# Altium project RV901-cnc.PrjPcb
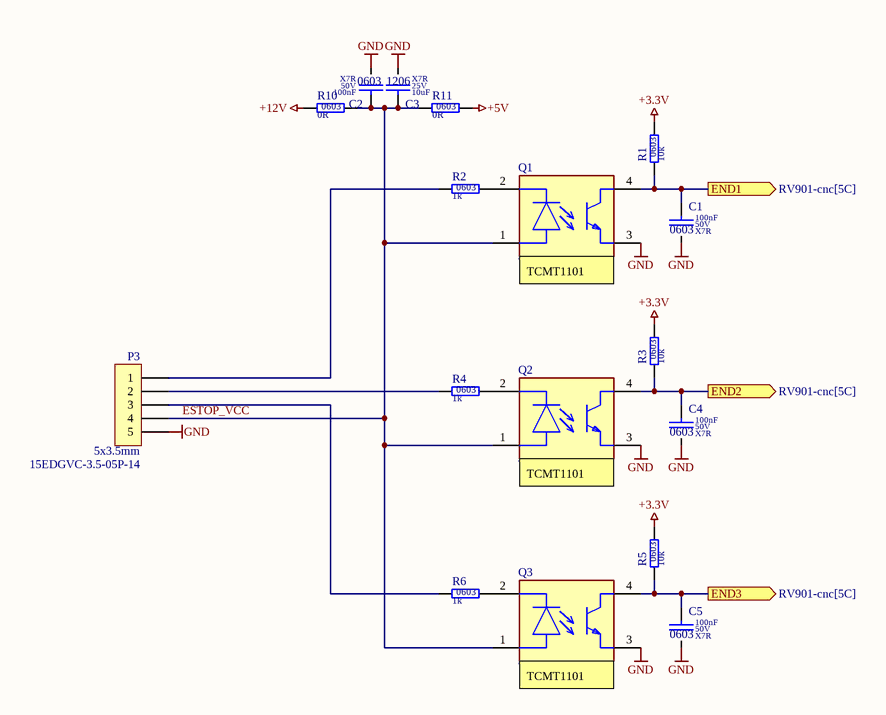
[diagram p0: Endstop.SchDoc]
7 sheets, 134 parts. Net scope: flat (ports and power ports of the same name join across sheets).
Board files: RV901-cnc-flipped.PcbDoc, RV901-cnc.PcbDoc
Sheets:
  Endstop.SchDoc
  Axis.SchDoc
  Encoder.SchDoc
  Serial.SchDoc
  GPI.SchDoc
  GPO.SchDoc
  Power.SchDoc

## Sheet Endstop.SchDoc
size A4; SheetNumber: 2; SheetTotal: 8

### Parts
C1  value 100nF  Dielectric: X7R  Voltage: 50V  SCH_Footprint: 0603  [C_0603_1608]  (hidden comment: Ceramic X7R)
C2  value 100nF  Dielectric: X7R  Voltage: 50V  SCH_Footprint: 0603  [C_0603_1608]  (hidden comment: Ceramic X7R)
C3  value 10uF  Dielectric: X7R  Voltage: 25V  SCH_Footprint: 1206  [C_1206_3216]  (hidden comment: Ceramic X7R)
C4  value 100nF  Dielectric: X7R  Voltage: 50V  SCH_Footprint: 0603  [C_0603_1608]  (hidden comment: Ceramic X7R)
C5  value 100nF  Dielectric: X7R  Voltage: 50V  SCH_Footprint: 0603  [C_0603_1608]  (hidden comment: Ceramic X7R)
P3  value 15EDGVC-3.5-05P-14  SCH_Footprint: 5x3.5mm  [P_15EDGVC-3.5-05P]  (hidden comment: 5-pin 3.5mm terminal block)
Q1  TCMT1106  [FP-TCMT1106-MFG]
Q2  TCMT1106  [FP-TCMT1106-MFG]
Q3  TCMT1106  [FP-TCMT1106-MFG]
R1  value 10k  SCH_Footprint: 0603  [R_0603_1608]  (hidden comment: Resistor)
R2  value 1k  SCH_Footprint: 0603  [R_0603_1608]  (hidden comment: Resistor)
R3  value 10k  SCH_Footprint: 0603  [R_0603_1608]  (hidden comment: Resistor)
R4  value 1k  SCH_Footprint: 0603  [R_0603_1608]  (hidden comment: Resistor)
R5  value 10k  SCH_Footprint: 0603  [R_0603_1608]  (hidden comment: Resistor)
R6  value 1k  SCH_Footprint: 0603  [R_0603_1608]  (hidden comment: Resistor)
R10  value 0R  SCH_Footprint: 0603  [R_0603_1608]  (hidden comment: Resistor)
R11  value 0R  SCH_Footprint: 0603  [R_0603_1608]  (hidden comment: Resistor)

### Ports
END1 (out, see RV901-cnc[5C]), END2 (out, see RV901-cnc[5C]), END3 (out, see RV901-cnc[5C])

### Nets
+3.3V: R1.2 R3.2 R5.2
+5V: R11.2
+12V: R10.1
GND: C1.2 C2.2 C3.2 C4.2 C5.2 P3.5 Q1.3(E) Q2.3(E) Q3.3(E)
ESTOP_VCC: C2.1 C3.1 P3.4 Q1.1(A) Q2.1(A) Q3.1(A) R10.2 R11.1
NetC1_1: C1.1 Q1.4(C) R1.1 ; port END1
NetC4_1: C4.1 Q2.4(C) R3.1 ; port END2
NetC5_1: C5.1 Q3.4(C) R5.1 ; port END3
NetP3_1: P3.1 R2.1
NetP3_2: P3.2 R4.1
NetP3_3: P3.3 R6.1
NetQ1_2: Q1.2(C) R2.2
NetQ2_2: Q2.2(C) R4.2
NetQ3_2: Q3.2(C) R6.2

### Notes on the sheet
- (near Q1) TCMT1101
- (near Q2) TCMT1101
- (near Q3) TCMT1101

### Library data of the parts
C1 C2 C4 C5 = C_100nF_50V_X7R_0603_5: Capacitor; Manufacturer: Samsung; Manufacturer Part Number: CL10B104JB8NNNC; Tolerance (%): 5; Part Number: C_100nF_50V_X7R_0603_5; HelpURL: http://www.tme.eu/pl/Document/4a42202b32dab16128fe107dd69598cc/samsung-chip-cap.pdf; Supplier 1: TME; Supplier Part Number 1: CL10B104JB8NNNC; Supplier 2: RS Components; Supplier Part Number 2: 7665455; Supplier 3: Farnell; Supplier 4: Mouser; Supplier 5: Digi-Key; Supplier Part Number 5: 1276-1033-1-ND; Supplier 6: LCSC; Supplier Part Number 6: C24452
C3 = C_10uF_25V_X7R_1206_10: Capacitor; Manufacturer: Samsung; Manufacturer Part Number: CL31B106KAHNNNE; Tolerance (%): 10; Part Number: C_10uF_25V_X7R_1206_10; HelpURL: http://www.tme.eu/pl/Document/4a42202b32dab16128fe107dd69598cc/samsung-chip-cap.pdf; Supplier 1: TME; Supplier Part Number 1: CL31B106KAHNNNE; Supplier 2: RS Components; Supplier Part Number 2: 766-6773; Supplier 3: Farnell; Supplier Part Number 3: 3013526; Supplier 4: Mouser; Supplier Part Number 4: 187-CL31B106KAHNNNE; Supplier 5: Digi-Key; Supplier Part Number 5: 1276-1804-1-ND; Supplier 6: LCSC
P3 = P_15EDGVC-3.5-05P-14: Pin Header; Manufacturer: DEGSON ELECTRONICS; Part Number: P_15EDGVC-3.5-05P-14; HelpURL: https://www.tme.eu/Document/83e7173fe653a2d0e44585e87978945b/opr014R8.pdf; Manufacturer Part Number: 15EDGVC-3.5-05P-14; Supplier 1: TME; Supplier 2: RS Components; Supplier 3: Farnell; Supplier 4: Mouser; Supplier 5: Digi-Key; Supplier 6: LCSC; Supplier Part Number 6: C7603430; Supplier 7: Conrad; Supplier Part Number 7: 1327356
Q1-Q3 = CMP-00030-39642376-1: TCMT1106 TCMT1106 Vishay Transistor Output Optocouplers Phototransistor Out 3750Vrms1 Channel 4-SOP RoHS; Current Transfer Ratio: 300%; Reverse Voltage: 6V; Number of Channels: 1; Turn-Off Delay Time: 8.5µs; Power Dissipation: 250mW; Output Current per Channel: 50mA; Voltage Rating (DC): 70V; Forward Current: 60mA; Turn-On Delay Time: 9.5µs; Rise Time: 3s; Isolation Voltage: 3.75kV; Fall Time: 4.7s; Max Junction Temperature (Tj): 125°C; Collector Emitter Saturation Voltage: 300mV; Forward Voltage: 1.35V; Ambient Temperature Range High: 100°C; Height: 2.3mm; Mount: PCB, Surface Mount; Max Operating Temperature: 100°C; Radiation Hardening: No; RoHS: Compliant; Min Operating Temperature: -40°C; NexarPartId: 39642376; Number of Pins: 4; Output Voltage: 70V; Max Output Voltage: 70V; Reverse Breakdown Voltage: 6V; Voltage: 6V; Collector Emitter Voltage (VCEO): 70V; Number of Elements: 1; Max Collector Current: 50mA; Schedule B: 8541408000, 8541408000; Input Current: 50mA; Max Power Dissipation: 250mW; Packaging: Tape and Reel; Max Input Current: 60mA; Case/Package: SOP; Lead Free: Lead Free; REACH SVHC: Unknown
R1 R3 R5 = R_10k_0603_1_AECQ0: Manufacturer: Panasonic; Manufacturer Part Number: ERJ-3EKF1002V; Voltage: 75V; Power: 100mW; Tolerance: 1%; AEC-Q: 0; Part Number: R_10k_0603_1_AECQ0; HelpURL: https://industrial.panasonic.com/cdbs/www-data/pdf/RDA0000/AOA0000C304.pdf; Supplier 1: TME; Supplier Part Number 1: ERJ3EKF1002V; Supplier 2: RS Components; Supplier 3: Farnell; Supplier Part Number 3: 2303192; Supplier 4: Mouser; Supplier Part Number 4: 667-ERJ-3EKF1002V; Supplier 5: Digi-Key; Supplier Part Number 5: P10.0KHCT-ND; Supplier 6: LCSC; Supplier Part Number 6: C191124
R2 R4 R6 = R_1k_0603_1_AECQ0: Manufacturer: Panasonic; Manufacturer Part Number: ERJ-3EKF1001V; Voltage: 75V; Power: 100mW; Tolerance: 1%; AEC-Q: 0; Part Number: R_1k_0603_1_AECQ0; HelpURL: https://industrial.panasonic.com/cdbs/www-data/pdf/RDA0000/AOA0000C304.pdf; Supplier 1: TME; Supplier Part Number 1: ERJ3EKF1001V; Supplier 2: RS Components; Supplier 3: Farnell; Supplier Part Number 3: 2303145; Supplier 4: Mouser; Supplier Part Number 4: 667-ERJ-3EKF1001V; Supplier 5: Digi-Key; Supplier Part Number 5: P1.00KHCT-ND; Supplier 6: LCSC
R10 R11 = R_0R_0603_1: Manufacturer: Yageo; Manufacturer Part Number: RC0603FR-070RL; Voltage: 75V; Power: 100mW; Tolerance: 1%; Part Number: R_0R_0603_1; HelpURL: https://datasheet.octopart.com/RC0603FR-070RL-Yageo-datasheet-8328172.pdf; Supplier 1: TME; Supplier Part Number 1: RC0603FR-070RL; Supplier 2: RS Components; Supplier 3: Farnell; Supplier Part Number 3: 2309106; Supplier 4: Mouser; Supplier Part Number 4: 603-RC0603FR-070RL; Supplier 5: Digi-Key; Supplier Part Number 5: 311-0.0HRCT-ND; Supplier 6: LCSC; Supplier Part Number 6: C100044

## Sheet Axis.SchDoc
size A4; SheetNumber: 3; SheetTotal: 8
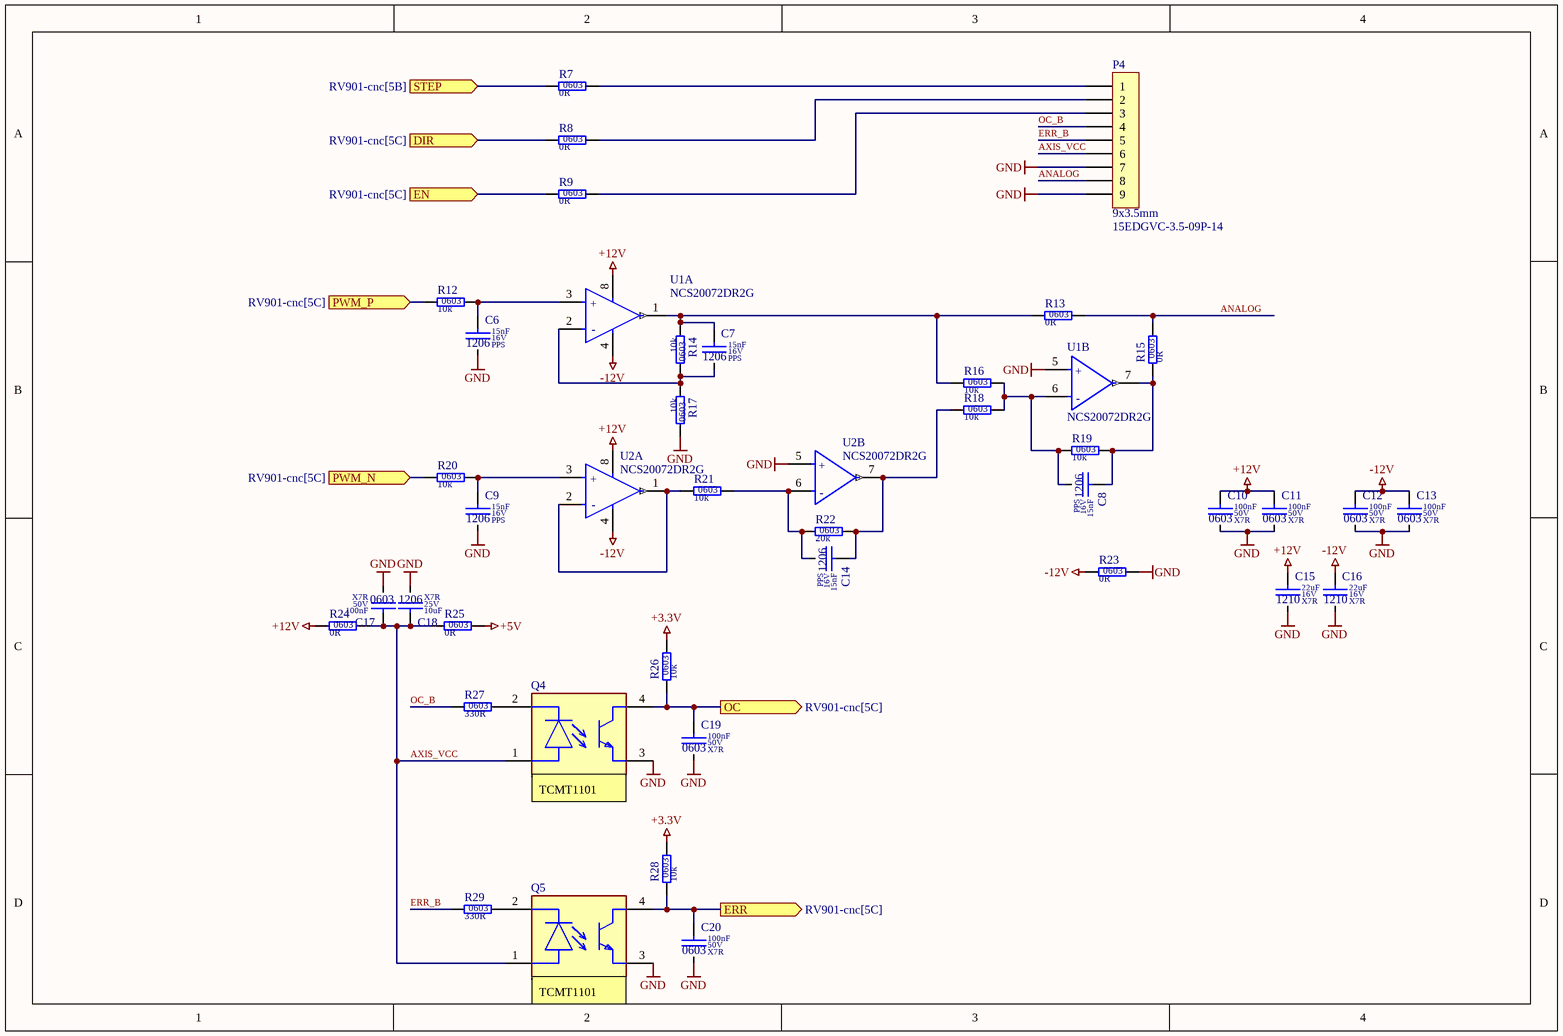
[diagram p1: Axis.SchDoc]

### Parts
C6  value 15nF  Dielectric: PPS  Voltage: 16V  SCH_Footprint: 1206  [C_1206_3216]  (hidden comment: Film Capacitor)
C7  value 15nF  Dielectric: PPS  Voltage: 16V  SCH_Footprint: 1206  [C_1206_3216]  (hidden comment: Film Capacitor)
C8  value 15nF  Dielectric: PPS  Voltage: 16V  SCH_Footprint: 1206  [C_1206_3216]  (hidden comment: Film Capacitor)
C9  value 15nF  Dielectric: PPS  Voltage: 16V  SCH_Footprint: 1206  [C_1206_3216]  (hidden comment: Film Capacitor)
C10  value 100nF  Dielectric: X7R  Voltage: 50V  SCH_Footprint: 0603  [C_0603_1608]  (hidden comment: Ceramic X7R)
C11  value 100nF  Dielectric: X7R  Voltage: 50V  SCH_Footprint: 0603  [C_0603_1608]  (hidden comment: Ceramic X7R)
C12  value 100nF  Dielectric: X7R  Voltage: 50V  SCH_Footprint: 0603  [C_0603_1608]  (hidden comment: Ceramic X7R)
C13  value 100nF  Dielectric: X7R  Voltage: 50V  SCH_Footprint: 0603  [C_0603_1608]  (hidden comment: Ceramic X7R)
C14  value 15nF  Dielectric: PPS  Voltage: 16V  SCH_Footprint: 1206  [C_1206_3216]  (hidden comment: Film Capacitor)
C15  value 22uF  Dielectric: X7R  Voltage: 16V  SCH_Footprint: 1210  [C_1210_3225]  (hidden comment: Ceramic X7R)
C16  value 22uF  Dielectric: X7R  Voltage: 16V  SCH_Footprint: 1210  [C_1210_3225]  (hidden comment: Ceramic X7R)
C17  value 100nF  Dielectric: X7R  Voltage: 50V  SCH_Footprint: 0603  [C_0603_1608]  (hidden comment: Ceramic X7R)
C18  value 10uF  Dielectric: X7R  Voltage: 25V  SCH_Footprint: 1206  [C_1206_3216]  (hidden comment: Ceramic X7R)
C19  value 100nF  Dielectric: X7R  Voltage: 50V  SCH_Footprint: 0603  [C_0603_1608]  (hidden comment: Ceramic X7R)
C20  value 100nF  Dielectric: X7R  Voltage: 50V  SCH_Footprint: 0603  [C_0603_1608]  (hidden comment: Ceramic X7R)
P4  value 15EDGVC-3.5-09P-14  SCH_Footprint: 9x3.5mm  [P_15EDGVC-3.5-09P]  (hidden comment: 9-pin 3.5mm terminal block)
Q4  TCMT1106  [FP-TCMT1106-MFG]
Q5  TCMT1106  [FP-TCMT1106-MFG]
R7  value 0R  SCH_Footprint: 0603  [R_0603_1608]  (hidden comment: Resistor)
R8  value 0R  SCH_Footprint: 0603  [R_0603_1608]  (hidden comment: Resistor)
R9  value 0R  SCH_Footprint: 0603  [R_0603_1608]  (hidden comment: Resistor)
R12  value 10k  SCH_Footprint: 0603  [R_0603_1608]  (hidden comment: Resistor)
R13  value 0R  SCH_Footprint: 0603  [R_0603_1608]  (hidden comment: Resistor)
R14  value 10k  SCH_Footprint: 0603  [R_0603_1608]  (hidden comment: Resistor)
R15  value 0R  SCH_Footprint: 0603  [R_0603_1608]  (hidden comment: Resistor)
R16  value 10k  SCH_Footprint: 0603  [R_0603_1608]  (hidden comment: Resistor)
R17  value 10k  SCH_Footprint: 0603  [R_0603_1608]  (hidden comment: Resistor)
R18  value 10k  SCH_Footprint: 0603  [R_0603_1608]  (hidden comment: Resistor)
R19  value 10k  SCH_Footprint: 0603  [R_0603_1608]  (hidden comment: Resistor)
R20  value 10k  SCH_Footprint: 0603  [R_0603_1608]  (hidden comment: Resistor)
R21  value 10k  SCH_Footprint: 0603  [R_0603_1608]  (hidden comment: Resistor)
R22  value 20k  SCH_Footprint: 0603  [R_0603_1608]  (hidden comment: Resistor)
R23  value 0R  SCH_Footprint: 0603  [R_0603_1608]  (hidden comment: Resistor)
R24  value 0R  SCH_Footprint: 0603  [R_0603_1608]  (hidden comment: Resistor)
R25  value 0R  SCH_Footprint: 0603  [R_0603_1608]  (hidden comment: Resistor)
R26  value 10k  SCH_Footprint: 0603  [R_0603_1608]  (hidden comment: Resistor)
R27  value 330R  SCH_Footprint: 0603  [R_0603_1608]  (hidden comment: Resistor)
R28  value 10k  SCH_Footprint: 0603  [R_0603_1608]  (hidden comment: Resistor)
R29  value 330R  SCH_Footprint: 0603  [R_0603_1608]  (hidden comment: Resistor)
U1  NCS20072DR2G  [FP-751-07-MFG]  (parts A,B of 2)
U2  NCS20072DR2G  [FP-751-07-MFG]  (parts A,B of 2)

### Ports
DIR (in, see RV901-cnc[5C]), EN (in, see RV901-cnc[5C]), ERR (out, see RV901-cnc[5C]), OC (out, see RV901-cnc[5C]), PWM_N (in, see RV901-cnc[5C]), PWM_P (in, see RV901-cnc[5C]), STEP (in, see RV901-cnc[5B])

### Nets
+3.3V: R26.2 R28.2
+5V: R25.2
+12V: C10.1 C11.1 C15.1 R24.1 U1.8(VDD) U2.8(VDD)
-12V: C12.1 C13.1 C16.1 R23.1 U1.4(VSS) U2.4(VSS)
GND: C6.2 C9.2 C10.2 C11.2 C12.2 C13.2 C15.2 C16.2 C17.2 C18.2 C19.2 C20.2 P4.7 P4.9 Q4.3(E) Q5.3(E) R17.2 R23.2 U1.5(IN+_2) U2.5(IN+_2)
ANALOG: P4.8 R13.2 R15.2
AXIS_VCC: C17.1 C18.1 P4.6 Q4.1(A) Q5.1(A) R24.2 R25.1
ERR_B: P4.5 R29.1
OC_B: P4.4 R27.1
NetC6_1: C6.1 R12.2 U1.3(IN+_1)
NetC7_1: C7.1 R13.1 R14.1 R16.1 U1.1(OUT_1)
NetC7_2: C7.2 R14.2 R17.1 U1.2(IN-_1)
NetC8_1: C8.1 R15.1 R19.2 U1.7(OUT_2)
NetC8_2: C8.2 R16.2 R18.2 R19.1 U1.6(IN-_2)
NetC9_1: C9.1 R20.2 U2.3(IN+_1)
NetC14_1: C14.1 R18.1 R22.2 U2.7(OUT_2)
NetC14_2: C14.2 R21.2 R22.1 U2.6(IN-_2)
NetC19_1: C19.1 Q4.4(C) R26.1 ; port OC
NetC20_1: C20.1 Q5.4(C) R28.1 ; port ERR
NetP4_1: P4.1 R7.2
NetP4_2: P4.2 R8.2
NetP4_3: P4.3 R9.2
NetQ4_2: Q4.2(C) R27.2
NetQ5_2: Q5.2(C) R29.2
NetR7_1: R7.1 ; port STEP
NetR8_1: R8.1 ; port DIR
NetR9_1: R9.1 ; port EN
NetR12_1: R12.1 ; port PWM_P
NetR20_1: R20.1 ; port PWM_N
NetR21_1: R21.1 U2.1(OUT_1) U2.2(IN-_1)

### Notes on the sheet
- (near Q4) TCMT1101
- (near Q5) TCMT1101
- (in symbol CMP-07106-000003-1, part A) +; -
- (in symbol CMP-07106-000003-1, part B) +; -

### Library data of the parts
C6-C9 C14 = C_15nF_16V_PPS_1206_2: Capacitor; Manufacturer: Panasonic; Manufacturer Part Number: ECH-U1C153GX5; Tolerance (%): 2; Part Number: C_15nF_16V_PPS_1206_2; HelpURL: https://mediap.industry.panasonic.eu/assets/imported/industrial.panasonic.com/cdbs/www-data/pdf/RDI0000/ABD0000C173.pdf; Supplier 1: TME; Supplier Part Number 1: ECHU1C153GX5; Supplier 2: RS Components; Supplier Part Number 2: 414-7018; Supplier 3: Farnell; Supplier Part Number 3: 9694900; Supplier 4: Mouser; Supplier Part Number 4: 667-ECH-U1C153GX5; Supplier 5: Digi-Key; Supplier Part Number 5: PCF1179CT-ND; Supplier 6: LCSC
C10-C13 C17 C19 C20 = C_100nF_50V_X7R_0603_5: as C1 on sheet Endstop; Part Number: C_100nF_50V_X7R_0603_5; HelpURL: http://www.tme.eu/pl/Document/4a42202b32dab16128fe107dd69598cc/samsung-chip-cap.pdf; Supplier 1: TME; Supplier Part Number 1: CL10B104JB8NNNC; Supplier 2: RS Components; Supplier Part Number 2: 7665455; Supplier 3: Farnell; Supplier 4: Mouser; Supplier 5: Digi-Key; Supplier Part Number 5: 1276-1033-1-ND; Supplier 6: LCSC; Supplier Part Number 6: C24452
C15 C16 = C_22uF_16V_X7R_1210_10_AECQ1: Capacitor; Manufacturer: Murata; Manufacturer Part Number: GCM32ER71C226KE19L; Tolerance (%): 10; AEC-Q: 1; Part Number: C_22uF_16V_X7R_1210_10_AECQ1; HelpURL: https://www.murata.com/products/productdetail?partno=GCM32ER71C226KE19%23; Supplier 1: TME; Supplier Part Number 1: GCM32ER71C226KE19L; Supplier 2: RS Components; Supplier 3: Farnell; Supplier Part Number 3: 3790409; Supplier 4: Mouser; Supplier Part Number 4: 81-GCM32ER71C226K19L; Supplier 5: Digi-Key; Supplier Part Number 5: 490-5242-1-ND; Supplier 6: LCSC; Supplier Part Number 6: C126614
C18 = C_10uF_25V_X7R_1206_10: as C3 on sheet Endstop; Part Number: C_10uF_25V_X7R_1206_10; HelpURL: http://www.tme.eu/pl/Document/4a42202b32dab16128fe107dd69598cc/samsung-chip-cap.pdf; Supplier 1: TME; Supplier Part Number 1: CL31B106KAHNNNE; Supplier 2: RS Components; Supplier Part Number 2: 766-6773; Supplier 3: Farnell; Supplier Part Number 3: 3013526; Supplier 4: Mouser; Supplier Part Number 4: 187-CL31B106KAHNNNE; Supplier 5: Digi-Key; Supplier Part Number 5: 1276-1804-1-ND; Supplier 6: LCSC
P4 = P_15EDGVC-3.5-09P-14: Pin Header; Manufacturer: DEGSON ELECTRONICS; Part Number: P_15EDGVC-3.5-09P-14; HelpURL: https://www.tme.eu/Document/83e7173fe653a2d0e44585e87978945b/opr014R8.pdf; Manufacturer Part Number: 15EDGVC-3.5-09P-14; Supplier 1: TME; Supplier 2: RS Components; Supplier 3: Farnell; Supplier 4: Mouser; Supplier 5: Digi-Key; Supplier 6: LCSC; Supplier Part Number 6: C5188325; Supplier 7: Micros; Supplier Part Number 7: Z TLPHC001v-09p
Q4 Q5 = CMP-00030-39642376-1: as Q1 on sheet Endstop; Ambient Temperature Range High: 100°C; Height: 2.3mm; Mount: PCB, Surface Mount; Max Operating Temperature: 100°C; Radiation Hardening: No; RoHS: Compliant; Min Operating Temperature: -40°C; NexarPartId: 39642376; Number of Pins: 4; Output Voltage: 70V; Max Output Voltage: 70V; Reverse Breakdown Voltage: 6V; Voltage: 6V; Collector Emitter Voltage (VCEO): 70V; Number of Elements: 1; Max Collector Current: 50mA; Schedule B: 8541408000, 8541408000; Input Current: 50mA; Max Power Dissipation: 250mW; Packaging: Tape and Reel; Max Input Current: 60mA; Case/Package: SOP; Lead Free: Lead Free; REACH SVHC: Unknown
R7-R9 R13 R15 R23-R25 = R_0R_0603_1: as R10 on sheet Endstop; Part Number: R_0R_0603_1; HelpURL: https://datasheet.octopart.com/RC0603FR-070RL-Yageo-datasheet-8328172.pdf; Supplier 1: TME; Supplier Part Number 1: RC0603FR-070RL; Supplier 2: RS Components; Supplier 3: Farnell; Supplier Part Number 3: 2309106; Supplier 4: Mouser; Supplier Part Number 4: 603-RC0603FR-070RL; Supplier 5: Digi-Key; Supplier Part Number 5: 311-0.0HRCT-ND; Supplier 6: LCSC; Supplier Part Number 6: C100044
R12 R14 R16-R21 R26 R28 = R_10k_0603_1_AECQ0: as R1 on sheet Endstop; Part Number: R_10k_0603_1_AECQ0; HelpURL: https://industrial.panasonic.com/cdbs/www-data/pdf/RDA0000/AOA0000C304.pdf; Supplier 1: TME; Supplier Part Number 1: ERJ3EKF1002V; Supplier 2: RS Components; Supplier 3: Farnell; Supplier Part Number 3: 2303192; Supplier 4: Mouser; Supplier Part Number 4: 667-ERJ-3EKF1002V; Supplier 5: Digi-Key; Supplier Part Number 5: P10.0KHCT-ND; Supplier 6: LCSC; Supplier Part Number 6: C191124
R22 = R_20k_0603_1_AECQ0: Manufacturer: Panasonic; Manufacturer Part Number: ERJ-3EKF2002V; Voltage: 75V; Power: 100mW; Tolerance: 1%; AEC-Q: 0; Part Number: R_20k_0603_1_AECQ0; HelpURL: https://industrial.panasonic.com/cdbs/www-data/pdf/RDA0000/AOA0000C304.pdf; Supplier 1: TME; Supplier Part Number 1: ERJ3EKF2002V; Supplier 2: RS Components; Supplier 3: Farnell; Supplier Part Number 3: 2059432; Supplier 4: Mouser; Supplier Part Number 4: 667-ERJ-3EKF2002V; Supplier 5: Digi-Key; Supplier Part Number 5: P20.0KHCT-ND; Supplier 6: LCSC; Supplier Part Number 6: C403057
R27 R29 = R_330R_0603_1: Manufacturer: Yageo; Manufacturer Part Number: RC0603FR-07330RL; Voltage: 50V; Power: 100mW; Tolerance: 1%; Part Number: R_330R_0603_1; HelpURL: http://datasheet.octopart.com/RC0603FR-07330RL-Yageo-datasheet-8328172.pdf; Supplier 1: TME; Supplier Part Number 1: RC0603FR-07330R; Supplier 2: RS Components; Supplier Part Number 2: 5046499; Supplier 3: Farnell; Supplier Part Number 3: 9238425; Supplier 4: Mouser; Supplier Part Number 4: 603-RC0603FR-07330RL; Supplier 5: Digi-Key; Supplier Part Number 5: 311-330HRCT-ND; Supplier 6: LCSC
U1 U2 = CMP-07106-000003-1: IC OPAMP 3MHZ RRO DUAL 8SOIC; Manufacturer: ON Semiconductor; Standoff Height: 0.1mm; Voltage Gain: 118-120dB; Max Junction Temp: +150°C; Min Supply Voltage: 2.7V; Max Dual Supply Voltage: 18V; Output Current Per Channel: 465uA; Input Bias Current: 0.000005uA; Input Offset Voltage: 1.3mV; Min Dual Supply Voltage: 1.35V; Max Supply Voltage: 36V; Nominal Supply Current: 405-465uA; Number Of Channels: 2; Gain Bandwidth: 3MHz; Temperature: -40°C to +125°C; Temperature Range High: +125°C; Ambient Temperature Range Low: -40°C; Device Class L1: Integrated Circuits (ICs); ComponentLink2Description: Datasheet; Package: 751-07; Lead Free: Yes; ComponentLink2URL: http://www.onsemi.com/pub/Collateral/NCS20071-D.PDF; Mouser Description: Operational Amplifiers - Op Amps R2R DUAL AMPLIFIER; Manufacturer Part Number: NCS20072DR2G; Octopart: https://octopart.com/ncs20072dr2g-on+semiconductor-56676507; Automotive: No; Device Class L3: Amplifiers - Op Amps; Device Class L2: Linear ICs; Category: IC; Bandwidth: 3MHz; Footprint Url: http://www.onsemi.com/pub/Collateral/751-07.PDF; RoHS: TRUE; Temperature Range Low: -40°C; Ambient Temperature Range High: +125°C; Height: 1.75mm; Digikey Description: IC OPAMP 3MHZ RRO DUAL 8SOIC

## Sheet Encoder.SchDoc
size A4; SheetNumber: 4; SheetTotal: 8
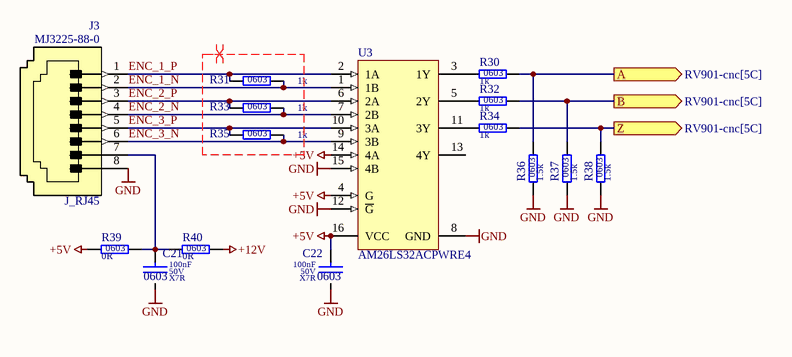
[diagram p2: Encoder.SchDoc]

### Parts
C21  value 100nF  Dielectric: X7R  Voltage: 50V  SCH_Footprint: 0603  [C_0603_1608]  (hidden comment: Ceramic X7R)
C22  value 100nF  Dielectric: X7R  Voltage: 50V  SCH_Footprint: 0603  [C_0603_1608]  (hidden comment: Ceramic X7R)
J3  value MJ3225-88-0  [J_RJ45_MJ3225-88-0]  (hidden comment: Modular Connector, Modular Jack, 1 x 1 (Port), 8P8C, Cat3)
R30  value 1k  SCH_Footprint: 0603  [R_0603_1608]  (hidden comment: Resistor)
R31  value 1k  SCH_Footprint: 0603  [R_0603_1608]  (hidden comment: Resistor)
R32  value 1k  SCH_Footprint: 0603  [R_0603_1608]  (hidden comment: Resistor)
R33  value 1k  SCH_Footprint: 0603  [R_0603_1608]  (hidden comment: Resistor)
R34  value 1k  SCH_Footprint: 0603  [R_0603_1608]  (hidden comment: Resistor)
R35  value 1k  SCH_Footprint: 0603  [R_0603_1608]  (hidden comment: Resistor)
R36  value 1.5k  SCH_Footprint: 0603  [R_0603_1608]  (hidden comment: Resistor)
R37  value 1.5k  SCH_Footprint: 0603  [R_0603_1608]  (hidden comment: Resistor)
R38  value 1.5k  SCH_Footprint: 0603  [R_0603_1608]  (hidden comment: Resistor)
R39  value 0R  SCH_Footprint: 0603  [R_0603_1608]  (hidden comment: Resistor)
R40  value 0R  SCH_Footprint: 0603  [R_0603_1608]  (hidden comment: Resistor)
U3  AM26LS32ACPWRE4  [PW16_L]

### Ports
A (out, see RV901-cnc[5C]), B (out, see RV901-cnc[5C]), Z (out, see RV901-cnc[5C])

### Nets
+5V: C22.1 R39.1 U3.4(G) U3.14(4A) U3.16(VCC)
+12V: R40.2
GND: C21.2 C22.2 J3.8 R36.1 R37.1 R38.1 U3.8(GND) U3.12(~{G}) U3.15(4B)
ENC_1_N: J3.2 R31.2 U3.1(1B)
ENC_1_P: J3.1 R31.1 U3.2(1A)
ENC_2_N: J3.4 R33.2 U3.7(2B)
ENC_2_P: J3.3 R33.1 U3.6(2A)
ENC_3_N: J3.6 R35.2 U3.9(3B)
ENC_3_P: J3.5 R35.1 U3.10(3A)
NetC21_1: C21.1 J3.7 R39.2 R40.1
NetR30_1: R30.1 U3.3(1Y)
NetR30_2: R30.2 R36.2 ; port A
NetR32_1: R32.1 U3.5(2Y)
NetR32_2: R32.2 R37.2 ; port B
NetR34_1: R34.1 U3.11(3Y)
NetR34_2: R34.2 R38.2 ; port Z

Not connected (* = marked no-connect by the designer): U3 13(4Y)

### Layout directives
differential pair: (no net found under the mark)

### Notes on the sheet
- (in symbol J_RJ45_MJ3225-88-0) J1; J2; J4; J5; J6; J7; J8

### Library data of the parts
C21 C22 = C_100nF_50V_X7R_0603_5: as C1 on sheet Endstop; Part Number: C_100nF_50V_X7R_0603_5; HelpURL: http://www.tme.eu/pl/Document/4a42202b32dab16128fe107dd69598cc/samsung-chip-cap.pdf; Supplier 1: TME; Supplier Part Number 1: CL10B104JB8NNNC; Supplier 2: RS Components; Supplier Part Number 2: 7665455; Supplier 3: Farnell; Supplier 4: Mouser; Supplier 5: Digi-Key; Supplier Part Number 5: 1276-1033-1-ND; Supplier 6: LCSC; Supplier Part Number 6: C24452
J3 = J_RJ45_MJ3225-88-0: Manufacturer: Global Connector Technology; SCH_Footprint: J_RJ45; Part Number: J_RJ45_MJ3225-88-0; HelpURL: https://www.farnell.com/cad/3781788.pdf; Manufacturer Part Number: MJ3225-88-0; Supplier 1: TME; Supplier 2: RS Components; Supplier 3: Farnell; Supplier Part Number 3: 4071641; Supplier 4: Mouser; Supplier 5: Digi-Key; Supplier 6: LCSC; Supplier 7: Newark; Supplier Part Number 7: 61AK4308
R30-R35 = R_1k_0603_1_AECQ0: as R2 on sheet Endstop; Part Number: R_1k_0603_1_AECQ0; HelpURL: https://industrial.panasonic.com/cdbs/www-data/pdf/RDA0000/AOA0000C304.pdf; Supplier 1: TME; Supplier Part Number 1: ERJ3EKF1001V; Supplier 2: RS Components; Supplier 3: Farnell; Supplier Part Number 3: 2303145; Supplier 4: Mouser; Supplier Part Number 4: 667-ERJ-3EKF1001V; Supplier 5: Digi-Key; Supplier Part Number 5: P1.00KHCT-ND; Supplier 6: LCSC
R36-R38 = R_1.5k_0603_1: Manufacturer: Yageo; Manufacturer Part Number: RC0603FR-071K5L; Voltage: 50V; Power: 100mW; Tolerance: 1%; Part Number: R_1.5k_0603_1; HelpURL: https://www.tme.eu/pl/Document/d2a72e545e5c8eb7bf2a04fa97535928/rc0603yageo.pdf; Supplier 1: TME; Supplier Part Number 1: RC0603FR-071K5; Supplier 2: RS Components; Supplier 3: Farnell; Supplier Part Number 3: 9238506; Supplier 4: Mouser; Supplier Part Number 4: 603-RC0603FR-071K5L; Supplier 5: Digi-Key; Supplier Part Number 5: 311-1.50KHRCT-ND; Supplier 6: LCSC
R39 R40 = R_0R_0603_1: as R10 on sheet Endstop; Part Number: R_0R_0603_1; HelpURL: https://datasheet.octopart.com/RC0603FR-070RL-Yageo-datasheet-8328172.pdf; Supplier 1: TME; Supplier Part Number 1: RC0603FR-070RL; Supplier 2: RS Components; Supplier 3: Farnell; Supplier Part Number 3: 2309106; Supplier 4: Mouser; Supplier Part Number 4: 603-RC0603FR-070RL; Supplier 5: Digi-Key; Supplier Part Number 5: 311-0.0HRCT-ND; Supplier 6: LCSC; Supplier Part Number 6: C100044
U3 = CMP-0310-00535-1: Quadruple Differential Line Receiver, 0 TX / 4 RX, 0 to 70 degC, 16-PinTSSOP (PW), Green (RoHS & no Sb/Br); Manufacturer: Texas Instruments; SubFamily: RS-422; ICC(Max)(mA): 70; Receivers Per Package: 4; Rating: Catalog; PackageReference: PW16; PackageDescription: 16-Pin Plastic Thin Small Outline Package 5 x 4.4 mm Body ,0.65 mm Pitch; ComponentLink2URL: http://www.ti.com/lit/ml/mpds361/mpds361.pdf; DatasheetVersion: SLLS115E; # of TX/RX: 0 TX / 4 RX; Eco-Plan: Green (RoHS & no Sb/Br); ComponentLink1URL: http://www.ti.com/general/docs/lit/getliterature.tsp?genericPartNumber=AM26LS32AC&fileType=pdf; ComponentLink1Description: Datasheet; Mounting Technology: Surface Mount; ComponentLink2Description: Package Specification; PackageVersion: revG, Feb-2011; Code_JEDEC: MO-153; PartNumber: AM26LS32ACPWRE4

## Sheet Serial.SchDoc
size A4; SheetNumber: 5; SheetTotal: 8
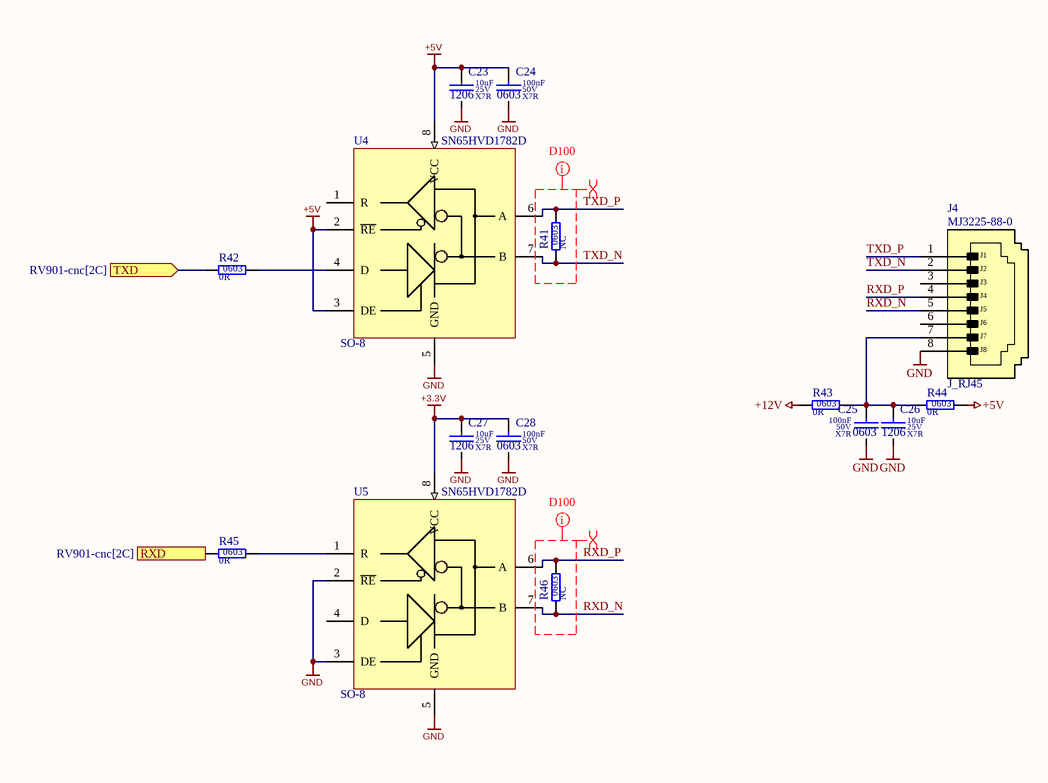
[diagram p3: Serial.SchDoc]

### Parts
C23  value 10uF  Dielectric: X7R  Voltage: 25V  SCH_Footprint: 1206  [C_1206_3216]  (hidden comment: Ceramic X7R)
C24  value 100nF  Dielectric: X7R  Voltage: 50V  SCH_Footprint: 0603  [C_0603_1608]  (hidden comment: Ceramic X7R)
C25  value 100nF  Dielectric: X7R  Voltage: 50V  SCH_Footprint: 0603  [C_0603_1608]  (hidden comment: Ceramic X7R)
C26  value 10uF  Dielectric: X7R  Voltage: 25V  SCH_Footprint: 1206  [C_1206_3216]  (hidden comment: Ceramic X7R)
C27  value 10uF  Dielectric: X7R  Voltage: 25V  SCH_Footprint: 1206  [C_1206_3216]  (hidden comment: Ceramic X7R)
C28  value 100nF  Dielectric: X7R  Voltage: 50V  SCH_Footprint: 0603  [C_0603_1608]  (hidden comment: Ceramic X7R)
J4  value MJ3225-88-0  [J_RJ45_MJ3225-88-0]  (hidden comment: Modular Connector, Modular Jack, 1 x 1 (Port), 8P8C, Cat3)
R41  value NC  SCH_Footprint: 0603  [R_NC_0603_1608]  (hidden comment: Resistor)
R42  value 0R  SCH_Footprint: 0603  [R_0603_1608]  (hidden comment: Resistor)
R43  value 0R  SCH_Footprint: 0603  [R_0603_1608]  (hidden comment: Resistor)
R44  value 0R  SCH_Footprint: 0603  [R_0603_1608]  (hidden comment: Resistor)
R45  value 0R  SCH_Footprint: 0603  [R_0603_1608]  (hidden comment: Resistor)
R46  value NC  SCH_Footprint: 0603  [R_NC_0603_1608]  (hidden comment: Resistor)
U4  value SN65HVD1782D  SCH_Footprint: SO-8  [SOP8_SO8_SOIC8_4X5X18]  (hidden comment: Transceiver)
U5  value SN65HVD1782D  SCH_Footprint: SO-8  [SOP8_SO8_SOIC8_4X5X18]  (hidden comment: Transceiver)

### Ports
RXD (out, see RV901-cnc[2C]), TXD (in, see RV901-cnc[2C])

### Nets
+3.3V: C27.1 C28.1 U5.8(VCC)
+5V: C23.1 C24.1 R44.2 U4.2(~{RE}) U4.3(DE) U4.8(VCC)
+12V: R43.1
GND: C23.2 C24.2 C25.2 C26.2 C27.2 C28.2 J4.8 U4.5(GND) U5.2(~{RE}) U5.3(DE) U5.5(GND)
RXD_N: J4.5 R46.1 U5.7(B)
RXD_P: J4.4 R46.2 U5.6(A)
TXD_N: J4.2 R41.1 U4.7(B)
TXD_P: J4.1 R41.2 U4.6(A)
NetC25_1: C25.1 C26.1 J4.7 R43.2 R44.1
NetR42_1: R42.1 ; port TXD
NetR42_2: R42.2 U4.4(D)
NetR45_1: R45.1 ; port RXD
NetR45_2: R45.2 U5.1(R)

Not connected (* = marked no-connect by the designer): J4 3 6; U4 1(R); U5 4(D)

### Layout directives
differential pair: (no net found under the mark)
net class D100: (no net found under the mark)

### Notes on the sheet
- (in symbol J_RJ45_MJ3225-88-0) J1; J2; J3; J5; J6; J7; J8

### Library data of the parts
C23 C26 C27 = C_10uF_25V_X7R_1206_10: as C3 on sheet Endstop; Part Number: C_10uF_25V_X7R_1206_10; HelpURL: http://www.tme.eu/pl/Document/4a42202b32dab16128fe107dd69598cc/samsung-chip-cap.pdf; Supplier 1: TME; Supplier Part Number 1: CL31B106KAHNNNE; Supplier 2: RS Components; Supplier Part Number 2: 766-6773; Supplier 3: Farnell; Supplier Part Number 3: 3013526; Supplier 4: Mouser; Supplier Part Number 4: 187-CL31B106KAHNNNE; Supplier 5: Digi-Key; Supplier Part Number 5: 1276-1804-1-ND; Supplier 6: LCSC
C24 C25 C28 = C_100nF_50V_X7R_0603_5: as C1 on sheet Endstop; Part Number: C_100nF_50V_X7R_0603_5; HelpURL: http://www.tme.eu/pl/Document/4a42202b32dab16128fe107dd69598cc/samsung-chip-cap.pdf; Supplier 1: TME; Supplier Part Number 1: CL10B104JB8NNNC; Supplier 2: RS Components; Supplier Part Number 2: 7665455; Supplier 3: Farnell; Supplier 4: Mouser; Supplier 5: Digi-Key; Supplier Part Number 5: 1276-1033-1-ND; Supplier 6: LCSC; Supplier Part Number 6: C24452
J4 = J_RJ45_MJ3225-88-0: as J3 on sheet Encoder; SCH_Footprint: J_RJ45; Part Number: J_RJ45_MJ3225-88-0; HelpURL: https://www.farnell.com/cad/3781788.pdf; Manufacturer Part Number: MJ3225-88-0; Supplier 1: TME; Supplier 2: RS Components; Supplier 3: Farnell; Supplier Part Number 3: 4071641; Supplier 4: Mouser; Supplier 5: Digi-Key; Supplier 6: LCSC; Supplier 7: Newark; Supplier Part Number 7: 61AK4308
R41 R46 = R_GENERIC_0603: Part Number: R_GENERIC_0603; HelpURL: -; Manufacturer: -; Manufacturer Part Number: -; Supplier 1: TME; Supplier 2: RS Components; Supplier 3: Farnell; Supplier 4: Mouser; Supplier 5: Digi-Key; Supplier 6: LCSC
R42-R45 = R_0R_0603_1: as R10 on sheet Endstop; Part Number: R_0R_0603_1; HelpURL: https://datasheet.octopart.com/RC0603FR-070RL-Yageo-datasheet-8328172.pdf; Supplier 1: TME; Supplier Part Number 1: RC0603FR-070RL; Supplier 2: RS Components; Supplier 3: Farnell; Supplier Part Number 3: 2309106; Supplier 4: Mouser; Supplier Part Number 4: 603-RC0603FR-070RL; Supplier 5: Digi-Key; Supplier Part Number 5: 311-0.0HRCT-ND; Supplier 6: LCSC; Supplier Part Number 6: C100044
U4 U5 = U_SN65HVD1782DR: Fault-Protected  RS-485  Transceivers  With 3.3-V to 5-V Operation; Manufacturer: Texas Instruments; Part Number: U_SN65HVD1782DR; HelpURL: http://www.ti.com/lit/ds/slls877h/slls877h.pdf; Manufacturer Part Number: SN65HVD1782D; Supplier 1: TME; Supplier 2: RS Components; Supplier Part Number 2: 7093179P; Supplier 3: Farnell; Supplier Part Number 3: 1755056; Supplier 4: Mouser; Supplier Part Number 4: 595-SN65HVD1782D; Supplier 5: Digi-Key; Supplier Part Number 5: 296-33574-5-ND; Supplier 6: LCSC

## Sheet GPI.SchDoc
size A4; SheetNumber: 6; SheetTotal: 8
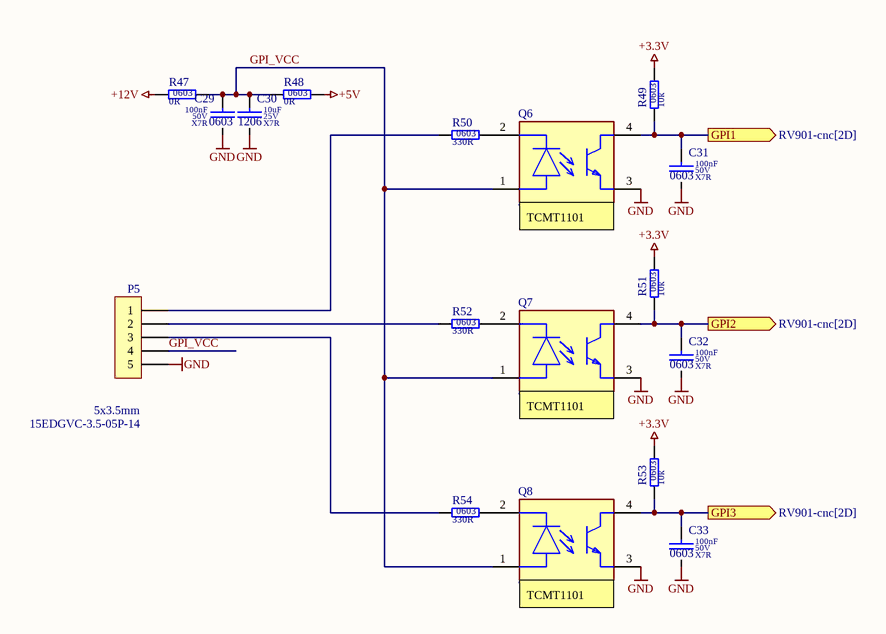
[diagram p4: GPI.SchDoc]

### Parts
C29  value 100nF  Dielectric: X7R  Voltage: 50V  SCH_Footprint: 0603  [C_0603_1608]  (hidden comment: Ceramic X7R)
C30  value 10uF  Dielectric: X7R  Voltage: 25V  SCH_Footprint: 1206  [C_1206_3216]  (hidden comment: Ceramic X7R)
C31  value 100nF  Dielectric: X7R  Voltage: 50V  SCH_Footprint: 0603  [C_0603_1608]  (hidden comment: Ceramic X7R)
C32  value 100nF  Dielectric: X7R  Voltage: 50V  SCH_Footprint: 0603  [C_0603_1608]  (hidden comment: Ceramic X7R)
C33  value 100nF  Dielectric: X7R  Voltage: 50V  SCH_Footprint: 0603  [C_0603_1608]  (hidden comment: Ceramic X7R)
P5  value 15EDGVC-3.5-05P-14  SCH_Footprint: 5x3.5mm  [P_15EDGVC-3.5-05P]  (hidden comment: 5-pin 3.5mm terminal block)
Q6  TCMT1106  [FP-TCMT1106-MFG]
Q7  TCMT1106  [FP-TCMT1106-MFG]
Q8  TCMT1106  [FP-TCMT1106-MFG]
R47  value 0R  SCH_Footprint: 0603  [R_0603_1608]  (hidden comment: Resistor)
R48  value 0R  SCH_Footprint: 0603  [R_0603_1608]  (hidden comment: Resistor)
R49  value 10k  SCH_Footprint: 0603  [R_0603_1608]  (hidden comment: Resistor)
R50  value 330R  SCH_Footprint: 0603  [R_0603_1608]  (hidden comment: Resistor)
R51  value 10k  SCH_Footprint: 0603  [R_0603_1608]  (hidden comment: Resistor)
R52  value 330R  SCH_Footprint: 0603  [R_0603_1608]  (hidden comment: Resistor)
R53  value 10k  SCH_Footprint: 0603  [R_0603_1608]  (hidden comment: Resistor)
R54  value 330R  SCH_Footprint: 0603  [R_0603_1608]  (hidden comment: Resistor)

### Ports
GPI1 (out, see RV901-cnc[2D]), GPI2 (out, see RV901-cnc[2D]), GPI3 (out, see RV901-cnc[2D])

### Nets
+3.3V: R49.2 R51.2 R53.2
+5V: R48.2
+12V: R47.1
GND: C29.2 C30.2 C31.2 C32.2 C33.2 P5.5 Q6.3(E) Q7.3(E) Q8.3(E)
GPI_VCC: C29.1 C30.1 P5.4 Q6.1(A) Q7.1(A) Q8.1(A) R47.2 R48.1
NetC31_1: C31.1 Q6.4(C) R49.1 ; port GPI1
NetC32_1: C32.1 Q7.4(C) R51.1 ; port GPI2
NetC33_1: C33.1 Q8.4(C) R53.1 ; port GPI3
NetP5_1: P5.1 R50.1
NetP5_2: P5.2 R52.1
NetP5_3: P5.3 R54.1
NetQ6_2: Q6.2(C) R50.2
NetQ7_2: Q7.2(C) R52.2
NetQ8_2: Q8.2(C) R54.2

### Notes on the sheet
- (near Q6) TCMT1101
- (near Q7) TCMT1101
- (near Q8) TCMT1101

### Library data of the parts
C29 C31-C33 = C_100nF_50V_X7R_0603_5: as C1 on sheet Endstop; Part Number: C_100nF_50V_X7R_0603_5; HelpURL: http://www.tme.eu/pl/Document/4a42202b32dab16128fe107dd69598cc/samsung-chip-cap.pdf; Supplier 1: TME; Supplier Part Number 1: CL10B104JB8NNNC; Supplier 2: RS Components; Supplier Part Number 2: 7665455; Supplier 3: Farnell; Supplier 4: Mouser; Supplier 5: Digi-Key; Supplier Part Number 5: 1276-1033-1-ND; Supplier 6: LCSC; Supplier Part Number 6: C24452
C30 = C_10uF_25V_X7R_1206_10: as C3 on sheet Endstop; Part Number: C_10uF_25V_X7R_1206_10; HelpURL: http://www.tme.eu/pl/Document/4a42202b32dab16128fe107dd69598cc/samsung-chip-cap.pdf; Supplier 1: TME; Supplier Part Number 1: CL31B106KAHNNNE; Supplier 2: RS Components; Supplier Part Number 2: 766-6773; Supplier 3: Farnell; Supplier Part Number 3: 3013526; Supplier 4: Mouser; Supplier Part Number 4: 187-CL31B106KAHNNNE; Supplier 5: Digi-Key; Supplier Part Number 5: 1276-1804-1-ND; Supplier 6: LCSC
P5 = P_15EDGVC-3.5-05P-14: as P3 on sheet Endstop; Part Number: P_15EDGVC-3.5-05P-14; HelpURL: https://www.tme.eu/Document/83e7173fe653a2d0e44585e87978945b/opr014R8.pdf; Manufacturer Part Number: 15EDGVC-3.5-05P-14; Supplier 1: TME; Supplier 2: RS Components; Supplier 3: Farnell; Supplier 4: Mouser; Supplier 5: Digi-Key; Supplier 6: LCSC; Supplier Part Number 6: C7603430; Supplier 7: Conrad; Supplier Part Number 7: 1327356
Q6-Q8 = CMP-00030-39642376-1: as Q1 on sheet Endstop; Ambient Temperature Range High: 100°C; Height: 2.3mm; Mount: PCB, Surface Mount; Max Operating Temperature: 100°C; Radiation Hardening: No; RoHS: Compliant; Min Operating Temperature: -40°C; NexarPartId: 39642376; Number of Pins: 4; Output Voltage: 70V; Max Output Voltage: 70V; Reverse Breakdown Voltage: 6V; Voltage: 6V; Collector Emitter Voltage (VCEO): 70V; Number of Elements: 1; Max Collector Current: 50mA; Schedule B: 8541408000, 8541408000; Input Current: 50mA; Max Power Dissipation: 250mW; Packaging: Tape and Reel; Max Input Current: 60mA; Case/Package: SOP; Lead Free: Lead Free; REACH SVHC: Unknown
R47 R48 = R_0R_0603_1: as R10 on sheet Endstop; Part Number: R_0R_0603_1; HelpURL: https://datasheet.octopart.com/RC0603FR-070RL-Yageo-datasheet-8328172.pdf; Supplier 1: TME; Supplier Part Number 1: RC0603FR-070RL; Supplier 2: RS Components; Supplier 3: Farnell; Supplier Part Number 3: 2309106; Supplier 4: Mouser; Supplier Part Number 4: 603-RC0603FR-070RL; Supplier 5: Digi-Key; Supplier Part Number 5: 311-0.0HRCT-ND; Supplier 6: LCSC; Supplier Part Number 6: C100044
R49 R51 R53 = R_10k_0603_1_AECQ0: as R1 on sheet Endstop; Part Number: R_10k_0603_1_AECQ0; HelpURL: https://industrial.panasonic.com/cdbs/www-data/pdf/RDA0000/AOA0000C304.pdf; Supplier 1: TME; Supplier Part Number 1: ERJ3EKF1002V; Supplier 2: RS Components; Supplier 3: Farnell; Supplier Part Number 3: 2303192; Supplier 4: Mouser; Supplier Part Number 4: 667-ERJ-3EKF1002V; Supplier 5: Digi-Key; Supplier Part Number 5: P10.0KHCT-ND; Supplier 6: LCSC; Supplier Part Number 6: C191124
R50 R52 R54 = R_330R_0603_1: as R27 on sheet Axis; Part Number: R_330R_0603_1; HelpURL: http://datasheet.octopart.com/RC0603FR-07330RL-Yageo-datasheet-8328172.pdf; Supplier 1: TME; Supplier Part Number 1: RC0603FR-07330R; Supplier 2: RS Components; Supplier Part Number 2: 5046499; Supplier 3: Farnell; Supplier Part Number 3: 9238425; Supplier 4: Mouser; Supplier Part Number 4: 603-RC0603FR-07330RL; Supplier 5: Digi-Key; Supplier Part Number 5: 311-330HRCT-ND; Supplier 6: LCSC

## Sheet GPO.SchDoc
size A4; SheetNumber: 7; SheetTotal: 8
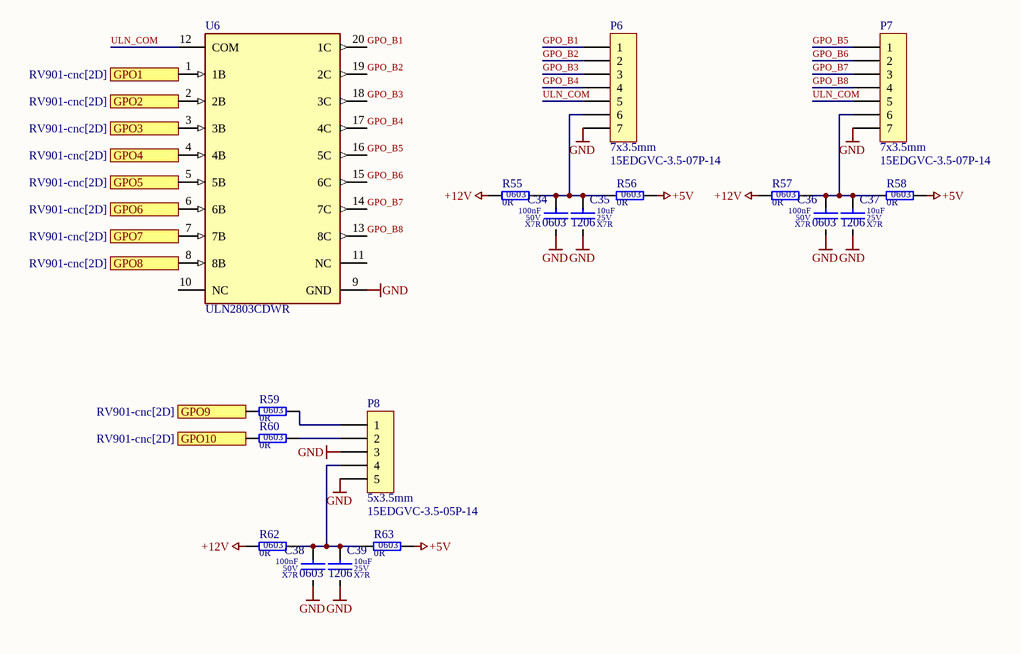
[diagram p5: GPO.SchDoc]

### Parts
C34  value 100nF  Dielectric: X7R  Voltage: 50V  SCH_Footprint: 0603  [C_0603_1608]  (hidden comment: Ceramic X7R)
C35  value 10uF  Dielectric: X7R  Voltage: 25V  SCH_Footprint: 1206  [C_1206_3216]  (hidden comment: Ceramic X7R)
C36  value 100nF  Dielectric: X7R  Voltage: 50V  SCH_Footprint: 0603  [C_0603_1608]  (hidden comment: Ceramic X7R)
C37  value 10uF  Dielectric: X7R  Voltage: 25V  SCH_Footprint: 1206  [C_1206_3216]  (hidden comment: Ceramic X7R)
C38  value 100nF  Dielectric: X7R  Voltage: 50V  SCH_Footprint: 0603  [C_0603_1608]  (hidden comment: Ceramic X7R)
C39  value 10uF  Dielectric: X7R  Voltage: 25V  SCH_Footprint: 1206  [C_1206_3216]  (hidden comment: Ceramic X7R)
P6  value 15EDGVC-3.5-07P-14  SCH_Footprint: 7x3.5mm  [P_15EDGVC-3.5-07P]  (hidden comment: 7-pin 3.5mm terminal block)
P7  value 15EDGVC-3.5-07P-14  SCH_Footprint: 7x3.5mm  [P_15EDGVC-3.5-07P]  (hidden comment: 7-pin 3.5mm terminal block)
P8  value 15EDGVC-3.5-05P-14  SCH_Footprint: 5x3.5mm  [P_15EDGVC-3.5-05P]  (hidden comment: 5-pin 3.5mm terminal block)
R55  value 0R  SCH_Footprint: 0603  [R_0603_1608]  (hidden comment: Resistor)
R56  value 0R  SCH_Footprint: 0603  [R_0603_1608]  (hidden comment: Resistor)
R57  value 0R  SCH_Footprint: 0603  [R_0603_1608]  (hidden comment: Resistor)
R58  value 0R  SCH_Footprint: 0603  [R_0603_1608]  (hidden comment: Resistor)
R59  value 0R  SCH_Footprint: 0603  [R_0603_1608]  (hidden comment: Resistor)
R60  value 0R  SCH_Footprint: 0603  [R_0603_1608]  (hidden comment: Resistor)
R62  value 0R  SCH_Footprint: 0603  [R_0603_1608]  (hidden comment: Resistor)
R63  value 0R  SCH_Footprint: 0603  [R_0603_1608]  (hidden comment: Resistor)
U6  ULN2803CDWR  [FP-DW0020A-MFG]

### Ports
GPO1 (in, see RV901-cnc[2D]), GPO2 (in, see RV901-cnc[2D]), GPO3 (in, see RV901-cnc[2D]), GPO4 (in, see RV901-cnc[2D]), GPO5 (in, see RV901-cnc[2D]), GPO6 (in, see RV901-cnc[2D]), GPO7 (in, see RV901-cnc[2D]), GPO8 (in, see RV901-cnc[2D]), GPO9 (in, see RV901-cnc[2D]), GPO10 (in, see RV901-cnc[2D])

### Nets
+5V: R56.2 R58.2 R63.2
+12V: R55.1 R57.1 R62.1
GND: C34.2 C35.2 C36.2 C37.2 C38.2 C39.2 P6.7 P7.7 P8.3 P8.5 U6.9(GND)
GPO_B1: P6.1 U6.20(1C)
GPO_B2: P6.2 U6.19(2C)
GPO_B3: P6.3 U6.18(3C)
GPO_B4: P6.4 U6.17(4C)
GPO_B5: P7.1 U6.16(5C)
GPO_B6: P7.2 U6.15(6C)
GPO_B7: P7.3 U6.14(7C)
GPO_B8: P7.4 U6.13(8C)
ULN_COM: P6.5 P7.5 U6.12(COM)
NetC34_1: C34.1 C35.1 P6.6 R55.2 R56.1
NetC36_1: C36.1 C37.1 P7.6 R57.2 R58.1
NetC38_1: C38.1 C39.1 P8.4 R62.2 R63.1
NetP8_1: P8.1 R59.2
NetP8_2: P8.2 R60.2
NetR59_1: R59.1 ; port GPO9
NetR60_1: R60.1 ; port GPO10
NetU6_1: U6.1(1B) ; port GPO1
NetU6_2: U6.2(2B) ; port GPO2
NetU6_3: U6.3(3B) ; port GPO3
NetU6_4: U6.4(4B) ; port GPO4
NetU6_5: U6.5(5B) ; port GPO5
NetU6_6: U6.6(6B) ; port GPO6
NetU6_7: U6.7(7B) ; port GPO7
NetU6_8: U6.8(8B) ; port GPO8

Not connected (* = marked no-connect by the designer): U6 10(NC) 11(NC)

### Library data of the parts
C34 C36 C38 = C_100nF_50V_X7R_0603_5: as C1 on sheet Endstop; Part Number: C_100nF_50V_X7R_0603_5; HelpURL: http://www.tme.eu/pl/Document/4a42202b32dab16128fe107dd69598cc/samsung-chip-cap.pdf; Supplier 1: TME; Supplier Part Number 1: CL10B104JB8NNNC; Supplier 2: RS Components; Supplier Part Number 2: 7665455; Supplier 3: Farnell; Supplier 4: Mouser; Supplier 5: Digi-Key; Supplier Part Number 5: 1276-1033-1-ND; Supplier 6: LCSC; Supplier Part Number 6: C24452
C35 C37 C39 = C_10uF_25V_X7R_1206_10: as C3 on sheet Endstop; Part Number: C_10uF_25V_X7R_1206_10; HelpURL: http://www.tme.eu/pl/Document/4a42202b32dab16128fe107dd69598cc/samsung-chip-cap.pdf; Supplier 1: TME; Supplier Part Number 1: CL31B106KAHNNNE; Supplier 2: RS Components; Supplier Part Number 2: 766-6773; Supplier 3: Farnell; Supplier Part Number 3: 3013526; Supplier 4: Mouser; Supplier Part Number 4: 187-CL31B106KAHNNNE; Supplier 5: Digi-Key; Supplier Part Number 5: 1276-1804-1-ND; Supplier 6: LCSC
P6 P7 = P_15EDGVC-3.5-07P-14: Pin Header; Manufacturer: DEGSON ELECTRONICS; Part Number: P_15EDGVC-3.5-07P-14; HelpURL: https://www.tme.eu/Document/83e7173fe653a2d0e44585e87978945b/opr014R8.pdf; Manufacturer Part Number: 15EDGVC-3.5-07P-14; Supplier 1: TME; Supplier 2: RS Components; Supplier 3: Farnell; Supplier 4: Mouser; Supplier 5: Digi-Key; Supplier 6: LCSC; Supplier Part Number 6: C5188323; Supplier 7: Conrad; Supplier Part Number 7: 1632093
P8 = P_15EDGVC-3.5-05P-14: as P3 on sheet Endstop; Part Number: P_15EDGVC-3.5-05P-14; HelpURL: https://www.tme.eu/Document/83e7173fe653a2d0e44585e87978945b/opr014R8.pdf; Manufacturer Part Number: 15EDGVC-3.5-05P-14; Supplier 1: TME; Supplier 2: RS Components; Supplier 3: Farnell; Supplier 4: Mouser; Supplier 5: Digi-Key; Supplier 6: LCSC; Supplier Part Number 6: C7603430; Supplier 7: Conrad; Supplier Part Number 7: 1327356
R55-R60 R62 R63 = R_0R_0603_1: as R10 on sheet Endstop; Part Number: R_0R_0603_1; HelpURL: https://datasheet.octopart.com/RC0603FR-070RL-Yageo-datasheet-8328172.pdf; Supplier 1: TME; Supplier Part Number 1: RC0603FR-070RL; Supplier 2: RS Components; Supplier 3: Farnell; Supplier Part Number 3: 2309106; Supplier 4: Mouser; Supplier Part Number 4: 603-RC0603FR-070RL; Supplier 5: Digi-Key; Supplier Part Number 5: 311-0.0HRCT-ND; Supplier 6: LCSC; Supplier Part Number 6: C100044
U6 = CMP-04912-000113-1: 50-V, EIGHT-CHANNEL DARLINGTON A

## Sheet Power.SchDoc
size A4; SheetNumber: 8; SheetTotal: 8
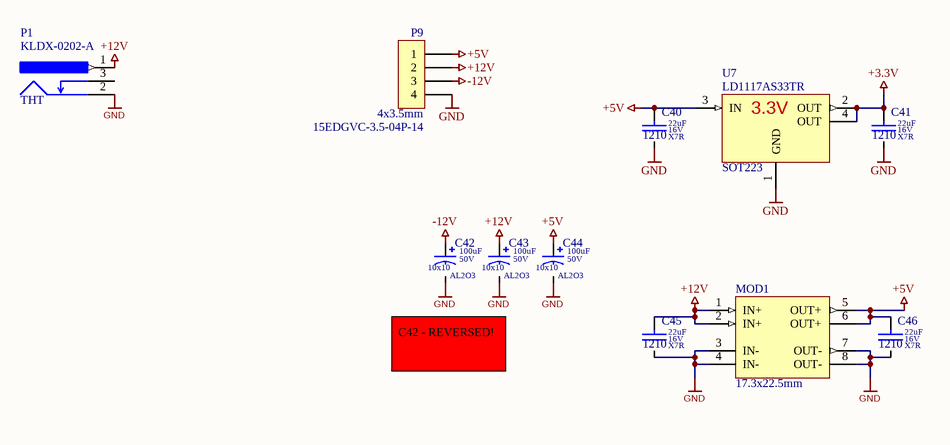
[diagram p6: Power.SchDoc]

### Parts
C40  value 22uF  Dielectric: X7R  Voltage: 16V  SCH_Footprint: 1210  [C_1210_3225]  (hidden comment: Ceramic X7R)
C41  value 22uF  Dielectric: X7R  Voltage: 16V  SCH_Footprint: 1210  [C_1210_3225]  (hidden comment: Ceramic X7R)
C42  value 100uF  Dielectric: AL2O3  SCH_Footprint: 10x10  Voltage: 50V  [CE_D_10x10_SMD]  (hidden comment: Electrolytic Capacitor)
C43  value 100uF  Dielectric: AL2O3  SCH_Footprint: 10x10  Voltage: 50V  [CE_D_10x10_SMD]  (hidden comment: Electrolytic Capacitor)
C44  value 100uF  Dielectric: AL2O3  SCH_Footprint: 10x10  Voltage: 50V  [CE_D_10x10_SMD]  (hidden comment: Electrolytic Capacitor)
C45  value 22uF  Dielectric: X7R  Voltage: 16V  SCH_Footprint: 1210  [C_1210_3225]  (hidden comment: Ceramic X7R)
C46  value 22uF  Dielectric: X7R  Voltage: 16V  SCH_Footprint: 1210  [C_1210_3225]  (hidden comment: Ceramic X7R)
MOD1  SCH_Footprint: 17.3x22.5mm  [MOD_BUCK_MP1584]  (hidden comment: Low cost, Aliexpress-ready DC-DC buck converter using MP1584)
P1  value KLDX-0202-A  SCH_Footprint: THT  [P_KLDX-0202-A]  (hidden comment: DC JACK)
P9  value 15EDGVC-3.5-04P-14  SCH_Footprint: 4x3.5mm  [P_15EDGVC-3.5-04P-14]  (hidden comment: 4-pin 3.5mm terminal block)
U7  SCH_Footprint: SOT223  [SOT223_SC73]  (hidden comment: LD1117AS33TR)

### Nets
+3.3V: C41.1 U7.2(OUT) U7.4(OUT)
+5V: C40.1 C44.1 C46.1 MOD1.5(OUT+) MOD1.6(OUT+) P9.1 U7.3(IN)
+12V: C43.1 C45.1 MOD1.1(IN+) MOD1.2(IN+) P1.1 P9.2
-12V: C42.1 P9.3
GND: C40.2 C41.2 C42.2 C43.2 C44.2 C45.2 C46.2 MOD1.3(IN-) MOD1.4(IN-) MOD1.7(OUT-) MOD1.8(OUT-) P1.2 P9.4 U7.1(GND)

Not connected (* = marked no-connect by the designer): P1 3

### Notes on the sheet
- C42 - REVERSED!

### Library data of the parts
C40 C41 C45 C46 = C_22uF_16V_X7R_1210_10_AECQ1: as C15 on sheet Axis; Part Number: C_22uF_16V_X7R_1210_10_AECQ1; HelpURL: https://www.murata.com/products/productdetail?partno=GCM32ER71C226KE19%23; Supplier 1: TME; Supplier Part Number 1: GCM32ER71C226KE19L; Supplier 2: RS Components; Supplier 3: Farnell; Supplier Part Number 3: 3790409; Supplier 4: Mouser; Supplier Part Number 4: 81-GCM32ER71C226K19L; Supplier 5: Digi-Key; Supplier Part Number 5: 490-5242-1-ND; Supplier 6: LCSC; Supplier Part Number 6: C126614
C42-C44 = CE_100uF_50V_AL2O3_10x10_20: Polarized Capacitor; Manufacturer: Nichicon; Manufacturer Part Number: UUX1H101MNL1GS; Tolerance (%): 20; Part Number: CE_100uF_50V_AL2O3_10x10_20; HelpURL: https://datasheet.octopart.com/UUX1H101MNL1GS-Nichicon-datasheet-62047998.pdf; Supplier 1: TME; Supplier Part Number 1: UUX1H101MNL1GS; Supplier 2: RS Components; Supplier Part Number 2: 7393107; Supplier 3: Farnell; Supplier Part Number 3: 2841943; Supplier 4: Mouser; Supplier Part Number 4: 647-UUX1H101MNL1GS; Supplier 5: Digi-Key; Supplier Part Number 5: 493-6269-1-ND; Supplier 6: LCSC
MOD1 = MOD_BUCK_MP1584: Value: -; Part Number: MOD_BUCK_MP1584; HelpURL: https://pl.aliexpress.com/item/32341006065.html; Manufacturer: -; Manufacturer Part Number: -; Supplier 1: TME; Supplier 2: RS Components; Supplier 3: Farnell; Supplier 4: Mouser; Supplier 5: Digi-Key; Supplier 6: LCSC; Supplier 7: -; Supplier Part Number 7: -
P1 = P_KLDX-0202-A: Typical 3-pin jack power connector with switch; Manufacturer: Kycon; Part Number: P_KLDX-0202-A; HelpURL: http://www.kycon.com/2013Catalogpage/DC%20Power/KLDX_0202.pdf; Manufacturer Part Number: KLDX-0202-A; Supplier 1: TME; Supplier 2: RS Components; Supplier 3: Farnell; Supplier Part Number 3: 2839850; Supplier 4: Mouser; Supplier Part Number 4: 806-KLDX-0202-A; Supplier 5: Digi-Key; Supplier Part Number 5: 2092-KLDX-0202-A-ND; Supplier 6: LCSC
P9 = P_15EDGVC-3.5-04P-14: Pin Header; Manufacturer: DEGSON ELECTRONICS; Part Number: P_15EDGVC-3.5-04P-14; HelpURL: https://www.tme.eu/Document/83e7173fe653a2d0e44585e87978945b/opr014R8.pdf; Manufacturer Part Number: 15EDGVC-3.5-04P-14; Supplier 1: TME; Supplier Part Number 1: 15EDGVC-3.5-04P; Supplier 2: RS Components; Supplier 3: Farnell; Supplier 4: Mouser; Supplier 5: Digi-Key; Supplier 6: LCSC
U7 = VL_LD1117AS33TR_3V3_1A2: typical configuration; Manufacturer: STMicroelectronics; Voltage: 3.3V; Current: 1.2A; Value: LD1117AS33TR; Part Number: VL_LD1117AS33TR_3V3_1A2; HelpURL: http://www.tme.eu/pl/Document/bad00e7fc591b73ff810af309b2bb7a4/LD1117A.pdf; Manufacturer Part Number: LD1117AS33TR; Supplier 1: TME; Supplier Part Number 1: LD1117AS33; Supplier 2: RS Components; Supplier 3: Farnell; Supplier Part Number 3: 1467776; Supplier 4: Mouser; Supplier Part Number 4: LD1117AS33; Supplier 5: Digi-Key; Supplier Part Number 5: 497-1228-1-ND; Supplier 6: LCSC

## Nets that join several sheets
+3.3V: Endstop (R1.2 R3.2 R5.2), Axis (R26.2 R28.2), Serial (C27.1 C28.1 U5.8), GPI (R49.2 R51.2 R53.2), Power (C41.1 U7.2 U7.4)
+5V: Endstop (R11.2), Axis (R25.2), Encoder (5 pins), Serial (6 pins), GPI (R48.2), GPO (R56.2 R58.2 R63.2), Power (7 pins)
+12V: Endstop (R10.1), Axis (6 pins), Encoder (R40.2), Serial (R43.1), GPI (R47.1), GPO (R55.1 R57.1 R62.1), Power (6 pins)
-12V: Axis (6 pins), Power (C42.1 P9.3)
GND: Endstop (9 pins), Axis (20 pins), Encoder (9 pins), Serial (11 pins), GPI (9 pins), GPO (11 pins), Power (14 pins)

## Assembly variants
ploter: not fitted C8A C8B C8C C8D C9A C9B C9C C9D C14A C14B C14C C14D MOD1 R11A R11B R11C R11D R15A R15B R15C R15D R16A R16B R16C R16D R18A R18B R18C R18D R24A R24B R24C R24D R40A R40B R40C R40D R41A R41B R43A R43B R46A R46B R47A R48B R55 R58 R62 U2A U2B U2C U2D U3A U3B U3C U3D U4A U4B U5A U5B; alternate parts R50B -> R_1k_0603_1_AECQ0, R54B -> R_1k_0603_1_AECQ0, R52B -> R_1k_0603_1_AECQ0, C7A -> C_4.7uF_50V_X7R_1206_10, C6A -> C_4.7uF_50V_X7R_1206_10, C6B -> C_4.7uF_50V_X7R_1206_10, C6C -> C_4.7uF_50V_X7R_1206_10, C6D -> C_4.7uF_50V_X7R_1206_10, C7B -> C_4.7uF_50V_X7R_1206_10, C7C -> C_4.7uF_50V_X7R_1206_10, C7D -> C_4.7uF_50V_X7R_1206_10
servos: not fitted MOD1 R11A R11B R11C R11D R13A R13B R13C R13D R23A R23B R23C R23D R24A R24B R24C R24D R40A R40B R40C R40D R41A R41B R43A R43B R46A R46B R47A R48B R55 R58 R62 U3A U3B U3C U3D U4A U4B U5A U5B; alternate parts R50B -> R_1k_0603_1_AECQ0, R54B -> R_1k_0603_1_AECQ0, R52B -> R_1k_0603_1_AECQ0
testing: not fitted C1A C1D C2A C2D C3A C3B C3C C3D C4A C4B C4C C4D C5A C5B C5C C5D C6A C6D C7A C7D C8A C8B C8D C9A C9B C9D C10A C10D C11A C11D C12A C12B C12D C13A C13B C13D C14A C14B C14D C15A C15D C16A C16B C16D C17A C17C C17D C18A C18C C18D C19A C19C C19D C20A C20B C20C C20D C21A C21C C21D C22A C22C C22D C23B C24B C25B C26B C27B C28B C29A C29B C30A C30B C31A C31B C32A C32B C33A C33B C34 C35 C36 C37 C38 C39 J3A J3C J3D J4B P3A P3D P4A P4D P5A P5B P7 P8 Q1A Q1D Q2A Q2B Q2C Q2D Q3A Q3B Q3C Q3D Q4A Q4C Q4D Q5A Q5B Q5C Q5D Q6A Q6B Q7A Q7B Q8A Q8B R1A R1D R2A R2D R3A R3B R3C R3D R4A R4B R4C R4D R5A R5B R5C R5D R6A R6B R6C R6D R7A R7C R7D R8A R8C R8D R9A R9C R9D R10A R10B R10D R11A R11C R11D R12A R12D R13A R13C R13D R14A R14D R15A R15B R15D R16A R16B R16D R17A R17D R18A R18B R18D R19A R19D R20A R20B R20D R21A R21B R21D R22A R22B R22D R23A R23C R23D R24A R24B R24C R24D R25A R25C R25D R26A R26C R26D R27A R27C R27D R28A R28B R28C R28D R29A R29B R29C R29D R30A R30C R30D R31A R31C R31D R32A R32C R32D R33A R33C R33D R34A R34C R34D R35A R35C R35D R36A R36C R36D R37A R37C R37D R38A R38C R38D R39A R39C R39D R40A R40B R40C R40D R41A R41B R42B R43A R43B R44B R45B R46A R46B R47A R47B R48A R48B R49A R49B R50A R50B R51A R51B R52A R52B R53A R53B R54A R54B R56 R57 R58 R59 R60 R62 R63 U1A U1D U2A U2B U2D U3A U3C U3D U4B U5B; alternate parts R2C -> R_1k_0603_1_AECQ0